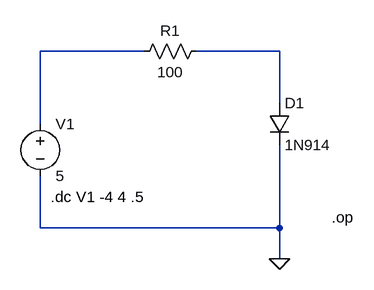
[diagram p0: schematic Part 1- DC analysis c.asc]
Part 1- DC analysis c.asc, the LTspice schematic file:
Version 4
SHEET 1 912 680
WIRE 352 208 192 208
WIRE 560 208 432 208
WIRE 560 288 560 208
WIRE 192 320 192 208
WIRE 192 480 192 400
WIRE 560 480 560 352
WIRE 560 480 192 480
WIRE 560 528 560 480
FLAG 560 528 0
SYMBOL voltage 192 304 R0
SYMATTR InstName V1
SYMATTR Value 5
SYMBOL res 448 192 R90
WINDOW 0 0 56 VBottom 2
WINDOW 3 32 56 VTop 2
SYMATTR InstName R1
SYMATTR Value 100
SYMBOL diode 544 288 R0
SYMATTR InstName D1
SYMATTR Value 1N914
TEXT 640 464 Left 2 !.op
TEXT 208 432 Left 2 !.dc V1 -4 4 .5

The netlist it stands for:
* Part 1- DC analysis c.asc
V1 N001 0 5
R1 N002 N001 100
D1 N002 0 1N914
.model D D
.lib standard.dio
.op
.dc V1 -4 4 .5
.backanno
.end